# EAGLE board main_board_v1_2 (EAGLE 9.2.2)
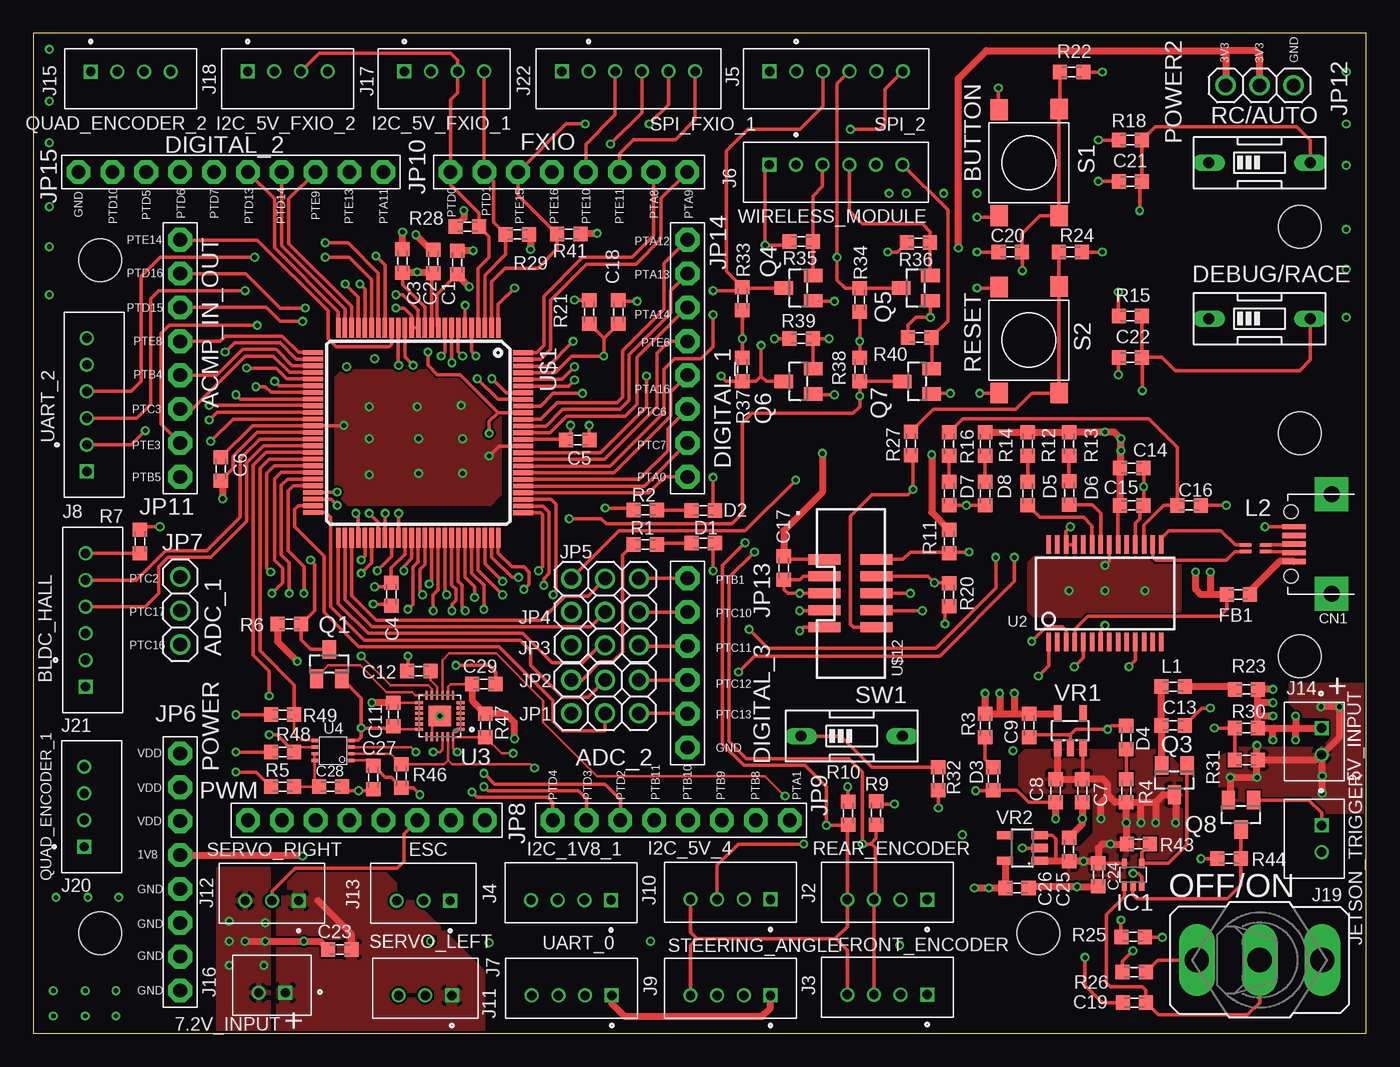
[diagram p9: board, top side]
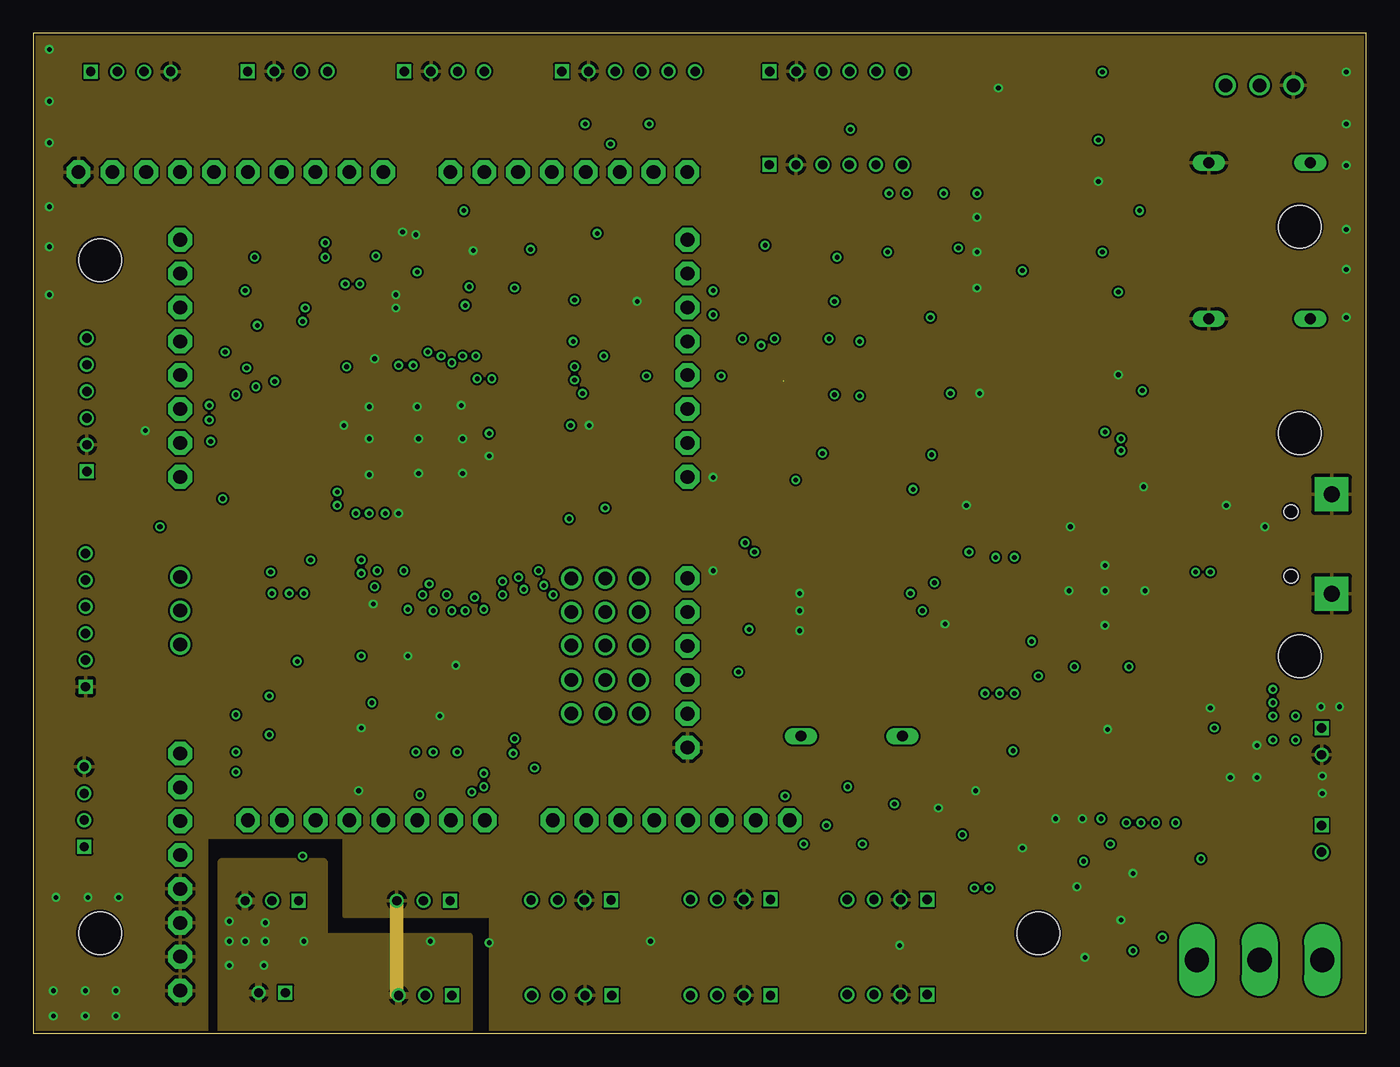
[diagram p10: board, inner layer GND]
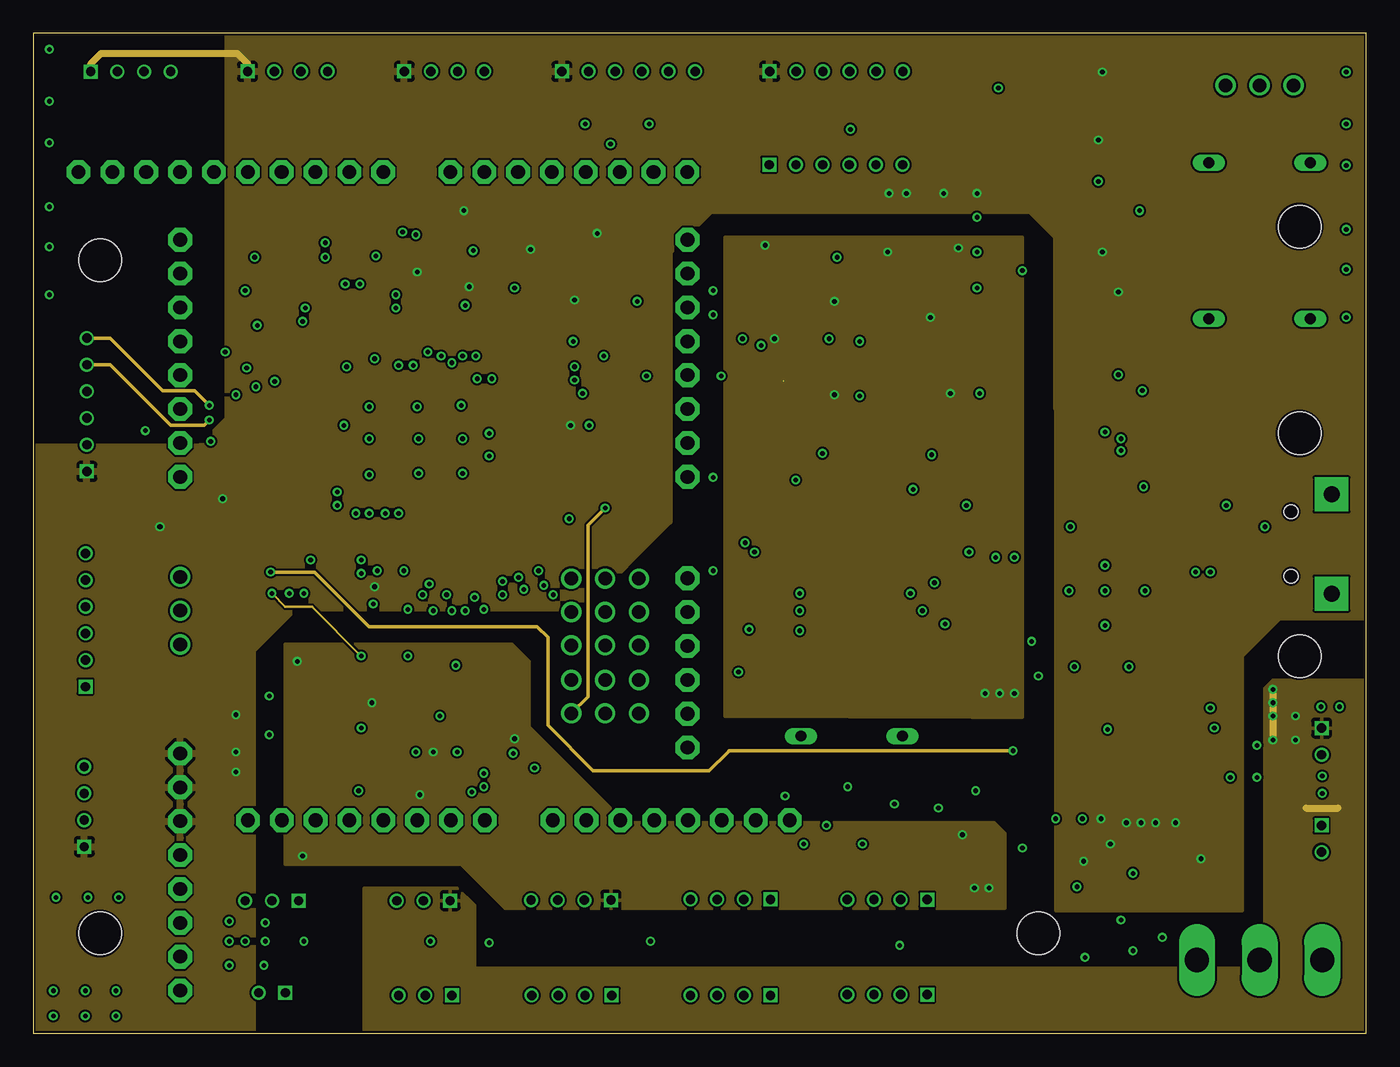
[diagram p11: board, inner layer POWER]
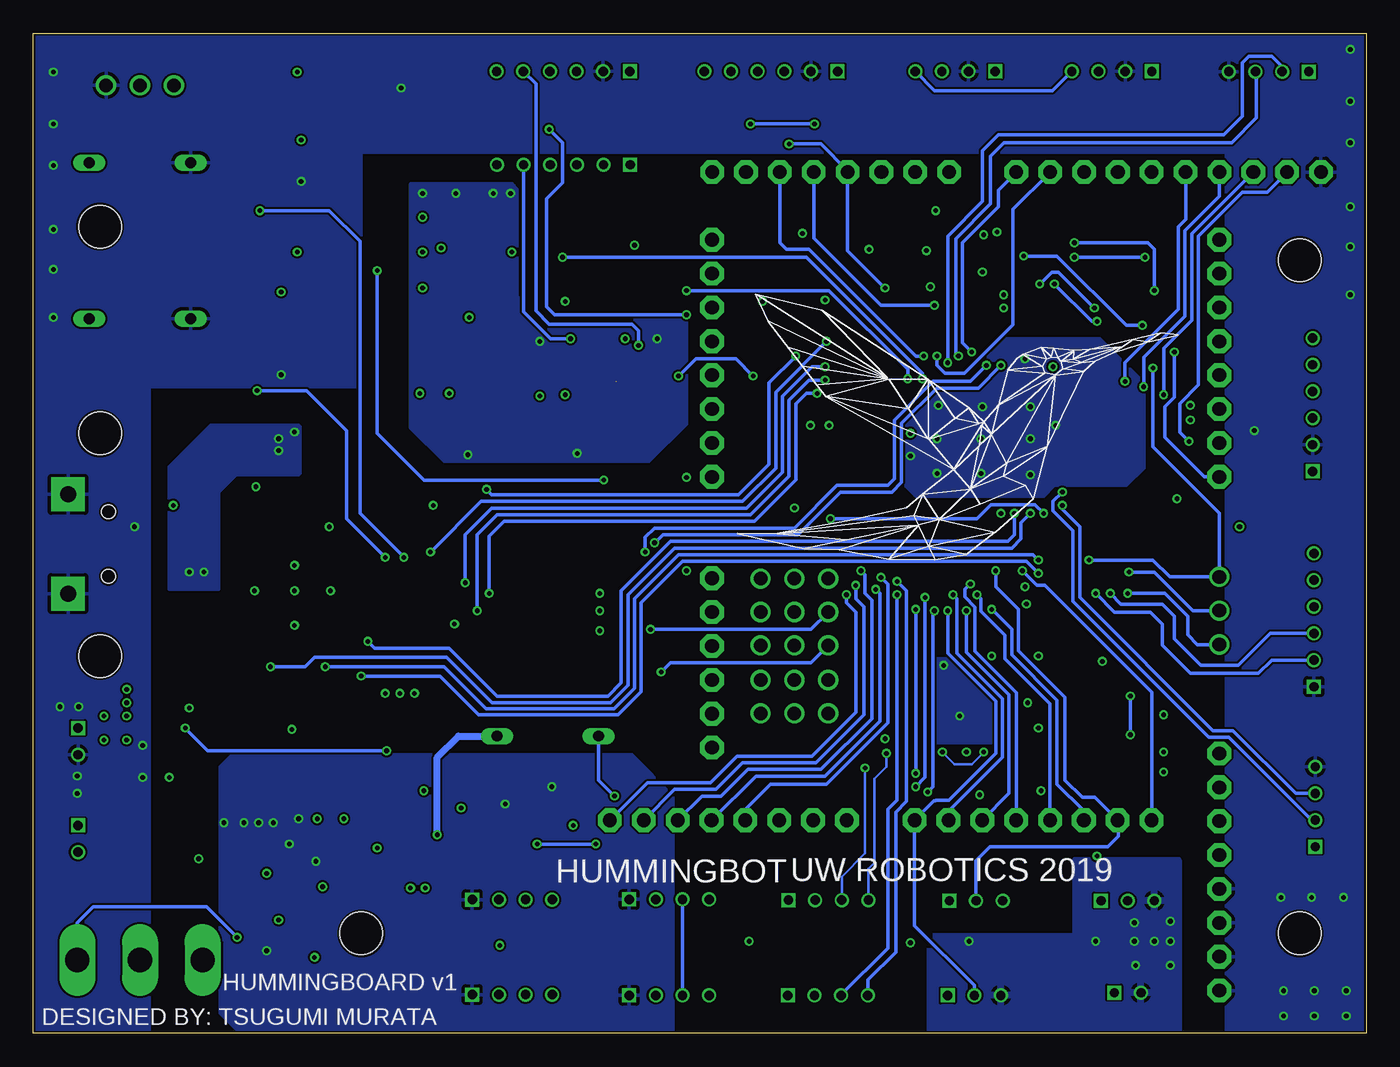
[diagram p12: board, bottom side, seen from below]

Size 100 x 75 mm. Coordinates in mm from the lower left corner, seen from the top.
Outline: 0,0 100,0 100,75 0,75 0,0
Copper layers (1*2*15*16): Top 0.035mm / dielectric 0.11mm / GND 0.035mm / dielectric 1.21mm / POWER 0.035mm / dielectric 0.11mm / Bottom 0.035mm
Design rules "PCBway_4layer_tsugumi *": minimum track width 6mil, minimum drill 12mil, track to track 6mil, track to pad 6mil, pad to pad 6mil, via to via 6mil, smd to smd 6mil, copper to edge 7mil, drill to drill 7mil, minimum pad ring 6mil, minimum via ring 6mil, stop-mask expansion 4mil, vias tented up to drill 25mil, thermal gap 10mil
Holes 3.2 mm at 5,7.5 95,45 95,28.3 75.4,7.5 5,58 95,60.5

## Footprints (pad centres in the part's own frame; a part is rotated, then mirrored left to right if it is on the bottom)
0603SMT = smd 1.05 x 1.08: 1 -0.875,0; 2 0.875,0
MICRO-USB = smd 0.4 x 1.75: 1 -1.3,4.525; 2 -0.65,4.525; 3 0,4.525; 4 0.65,4.525; 5 1.3,4.525 | drill 1.2 pad 2.54 square: GND1 -3.725,1.7; GND2 3.725,1.7 | hole 1.05: -2.425,4.73; 2.425,4.73
EDG-01 = drill 0.813 long: 1 0,-3.81; 2 0,3.81
SC70-5 = smd 0.4 x 0.7: 1 -0.65,-0.85; 2 0,-0.85; 3 0.65,-0.85; 4 0.65,0.85; 5 -0.65,0.85
JST_B4B-PH-K-S(LF)(SN) = drill 0.7 square: 1 3,-0.55 | drill 0.7: 2 1,-0.55; 3 -1,-0.55; 4 -3,-0.55
JST_B6B-PH-K-S(LF)(SN) = drill 0.7 square: 1 5,-0.55 | drill 0.7: 2 3,-0.55; 3 1,-0.55; 4 -1,-0.55; 5 -3,-0.55; 6 -5,-0.55
JST_B3B-PH-K-S(LF)(SN) = drill 0.7 square: 1 2,-0.55 | drill 0.7: 2 0,-0.55; 3 -2,-0.55
JST_B2B-PH-K-S(LF)(SN) = drill 0.7 square: 1 1,-0.55 | drill 0.7: 2 -1,-0.55
1X03 = drill 1.016: 1 -2.54,0; 2 0,0; 3 2.54,0
1X08-BIG = drill 1.016 pad 1.778 octagon: 1 -8.89,0; 2 -6.35,0; 3 -3.81,0; 4 -1.27,0; 5 1.27,0; 6 3.81,0; 7 6.35,0; 8 8.89,0
1X06-BIG = drill 1.016 pad 1.778 octagon: 1 -6.35,0; 2 -3.81,0; 3 -1.27,0; 4 1.27,0; 5 3.81,0; 6 6.35,0
1X10-BIG = drill 1.016 pad 1.778 octagon: 1 -11.43,0; 2 -8.89,0; 3 -6.35,0; 4 -3.81,0; 5 -1.27,0; 6 1.27,0; 7 3.81,0; 8 6.35,0; 9 8.89,0; 10 11.43,0
CHOKE0603 = smd 0.85 x 0.25: 1 -0.75,-0.25; 2 0.75,-0.25; 3 0.75,0.25; 4 -0.75,0.25
SOT23 = smd 1 x 1.4: 1 -0.95,-1.1; 2 0.95,-1.1; 3 0,1.1
TACT_SWITCH_SMT = smd 1.55 x 1.3: 1 -3.975,2.25; 2 3.975,2.25; 3 -3.975,-2.25; 4 4.025,-2.25
M9040P = drill 1.803 long: 1 0,4.699; 2 0,0; 3 0,-4.699
SSOP28DB = smd 0.348 x 1.397: 1 -4.225,-3.656; 2 -3.575,-3.656; 3 -2.925,-3.656; 4 -2.275,-3.656; 5 -1.625,-3.656; 6 -0.975,-3.656; 7 -0.325,-3.656; 8 0.325,-3.656; 9 0.975,-3.656; 10 1.625,-3.656; 11 2.275,-3.656; 12 2.925,-3.656; 13 3.575,-3.656; 14 4.225,-3.656; 15 4.225,3.656; 16 3.575,3.656; 17 2.925,3.656; 18 2.275,3.656; 19 1.625,3.656; 20 0.975,3.656; 21 0.325,3.656; 22 -0.325,3.656; 23 -0.975,3.656; 24 -1.625,3.656; 25 -2.275,3.656; 26 -2.925,3.656; 27 -3.575,3.656; 28 -4.225,3.656
QFN40P300X300X105-25N = smd 0.64 x 0.22: 1 -1.545,1; 2 -1.545,0.6; 3 -1.545,0.2; 4 -1.545,-0.2; 5 -1.545,-0.6; 6 -1.545,-1; 13 1.545,-1; 14 1.545,-0.6; 15 1.545,-0.2; 16 1.545,0.2; 17 1.545,0.6; 18 1.545,1 | smd 0.22 x 0.64: 7 -1,-1.545; 8 -0.6,-1.545; 9 -0.2,-1.545; 10 0.2,-1.545; 11 0.6,-1.545; 12 1,-1.545; 19 1,1.545; 20 0.6,1.545; 21 0.2,1.545; 22 -0.2,1.545; 23 -0.6,1.545; 24 -1,1.545 | smd 1.7 x 1.54: 25 0,0
PSOP-8 = smd 0.25 x 0.5: 1 -0.73,-1.37; 2 -0.23,-1.37; 3 0.27,-1.37; 4 0.77,-1.37; 5 0.77,1.38; 6 0.27,1.38; 7 -0.23,1.38; 8 -0.73,1.38
LQFP100 = smd 1.5 x 0.35: 1 -7.875,6; 2 -7.875,5.5; 3 -7.875,5; 4 -7.875,4.5; 5 -7.875,4; 6 -7.875,3.5; 7 -7.875,3; 8 -7.875,2.5; 9 -7.875,2; 10 -7.875,1.5; 11 -7.875,1; 12 -7.875,0.5; 13 -7.875,0; 14 -7.875,-0.5; 15 -7.875,-1; 16 -7.875,-1.5; 17 -7.875,-2; 18 -7.875,-2.5; 19 -7.875,-3; 20 -7.875,-3.5; 21 -7.875,-4; 22 -7.875,-4.5; 23 -7.875,-5; 24 -7.875,-5.5; 25 -7.875,-6; 51 7.875,-6; 52 7.875,-5.5; 53 7.875,-5; 54 7.875,-4.5; 55 7.875,-4; 56 7.875,-3.5; 57 7.875,-3; 58 7.875,-2.5; 59 7.875,-2; 60 7.875,-1.5; 61 7.875,-1; 62 7.875,-0.5; 63 7.875,0; 64 7.875,0.5; 65 7.875,1; 66 7.875,1.5; 67 7.875,2; 68 7.875,2.5; 69 7.875,3; 70 7.875,3.5; 71 7.875,4; 72 7.875,4.5; 73 7.875,5; 74 7.875,5.5; 75 7.875,6 | smd 0.35 x 1.5: 26 -6.025,-7.875; 27 -5.525,-7.875; 28 -5.025,-7.875; 29 -4.525,-7.875; 30 -4.025,-7.875; 31 -3.525,-7.875; 32 -3.025,-7.875; 33 -2.525,-7.875; 34 -2.025,-7.875; 35 -1.525,-7.875; 36 -1.025,-7.875; 37 -0.525,-7.875; 38 -0.025,-7.875; 39 0.475,-7.875; 40 0.975,-7.875; 41 1.475,-7.875; 42 1.975,-7.875; 43 2.475,-7.875; 44 2.975,-7.875; 45 3.475,-7.875; 46 3.975,-7.875; 47 4.475,-7.875; 48 4.975,-7.875; 49 5.475,-7.875; 50 5.975,-7.875; 76 6,7.875; 77 5.5,7.875; 78 5,7.875; 79 4.5,7.875; 80 4,7.875; 81 3.5,7.875; 82 3,7.875; 83 2.5,7.875; 84 2,7.875; 85 1.5,7.875; 86 1,7.875; 87 0.5,7.875; 88 0,7.875; 89 -0.5,7.875; 90 -1,7.875; 91 -1.5,7.875; 92 -2,7.875; 93 -2.5,7.875; 94 -3,7.875; 95 -3.5,7.875; 96 -4,7.875; 97 -4.5,7.875; 98 -5,7.875; 99 -5.5,7.875; 100 -6,7.875
SWD_1.27MM = smd 0.76 x 2.4: 1 -2.54,-1.94; 2 -2.54,1.94; 3 -1.27,-1.94; 4 -1.27,1.94; 5 0,-1.94; 6 0,1.94; 7 1.27,-1.94; 8 1.27,1.94; 9 2.54,-1.94; 10 2.54,1.94
SOT23-5 = smd 0.55 x 1.2: 1 -0.95,-1.3; 2 0,-1.3; 3 0.95,-1.3; 4 0.95,1.3; 5 -0.95,1.3
TSOT23-5 = smd 0.62 x 1.22: 1 -0.95,-1.3; 2 0,-1.3; 3 0.95,-1.3; 4 0.95,1.3; 5 -0.95,1.3

## Placement (x,y rotation side)
C1  100nF  [0603SMT]  31.8,57.81 90 top
C2  100nF  [0603SMT]  30,57.9 90 top
C3  100nF  [0603SMT]  27.7,57.93 90 top
C4  100nF  [0603SMT]  26.85,32.93 270 top
C5  100nF  [0603SMT]  40.85,44.49 0 top
C6  100nF  [0603SMT]  14.07,42.32 90 top
C7  10uF  [0603SMT]  78.7,18.2 270 top
C8  1uF  [0603SMT]  76.7,18.2 270 top
C9  1uF  [0603SMT]  74.7,23.1 270 top
C11  0.1uF  [0603SMT]  27.01,23.91 90 top
C12  0.1uF  [0603SMT]  28.93,27.17 180 top
C13  100ohm  [0603SMT]  85.5,23.1 0 top
C14  10uF  [0603SMT]  82.4,42.4 0 top
C15  0.1uF  [0603SMT]  82.4,39.6 0 top
C16  0.1uF  [0603SMT]  86.7,39.6 0 top
C17  0.1uF  [0603SMT]  56.3,34.9 270 top
C18  0.1uF  [0603SMT]  43.9,54.1 90 top
C19  0.1uF  [0603SMT]  82.6,2.3 180 top
C20  0.1uF  [0603SMT]  73.3,58.6 180 top
C21  0.1uF  [0603SMT]  82.3,63.9 180 top
C22  0.1uF  [0603SMT]  82.3,50.7 180 top
C23  TBD  [0603SMT]  23,6.3 180 top
C24  0.1u  [0603SMT]  79.9,11.9 90 top
C25  1uF  [0603SMT]  77.7,13.8 90 top
C26  1uF  [0603SMT]  73.8,10.9 0 top
C27  0.1u  [0603SMT]  25.5,19.2 90 top
C28  0.1u  [0603SMT]  22.3,18.5 180 top
C29  0.1uF  [0603SMT]  33.8,26.2 180 top
CN1  MIRCO_B  [MICRO-USB]  99.1,36.7 90 top
D1  LED0603  [0603SMT]  50.26,36.77 0 top
D2  LED0603  [0603SMT]  50.26,39.21 0 top
D3  LED_GREEN  [0603SMT]  72,19.1 270 top
D4  LED_GREEN  [0603SMT]  82,22.2 90 top
D5  TX  [0603SMT]  74.6,40.5 270 top
D6  RX  [0603SMT]  77.72,40.52 270 top
D7  LED0603  [0603SMT]  68.7,40.5 270 top
D8  LED0603  [0603SMT]  71.4,40.5 270 top
DEBUG/RACE  [EDG-01]  92,53.6 270 top
FB1  600ohm@100MHz  [0603SMT]  90.4,32.91 180 top
IC1  OR_SC70-5  [SC70-5]  82.5,11.9 0 top
J2  REAR_ENCODER  [JST_B4B-PH-K-S(LF)(SN)]  64.07,10.58 0 top
J3  FRONT_ENCODER  [JST_B4B-PH-K-S(LF)(SN)]  64.07,3.46 0 top
J4  I2C_1V8_1  [JST_B4B-PH-K-S(LF)(SN)]  40.34,10.54 0 top
J5  SPI_2  [JST_B6B-PH-K-S(LF)(SN)]  60.24,71.6 180 top
J6  WIRELESS_MODULE  [JST_B6B-PH-K-S(LF)(SN)]  60.22,64.6 180 top
J7  UART_0  [JST_B4B-PH-K-S(LF)(SN)]  40.39,3.4 0 top
J8  UART_2  [JST_B6B-PH-K-S(LF)(SN)]  4.57,47.14 270 top
J9  STEERING_ANGLE  [JST_B4B-PH-K-S(LF)(SN)]  52.3,3.4 0 top
J10  I2C_5V_4  [JST_B4B-PH-K-S(LF)(SN)]  52.3,10.6 0 top
J11  SERVO_LEFT  [JST_B3B-PH-K-S(LF)(SN)]  29.4,3.4 0 top
J12  SERVO_RIGHT  [JST_B3B-PH-K-S(LF)(SN)]  17.9,10.5 0 top
J13  ESC  [JST_B3B-PH-K-S(LF)(SN)]  29.27,10.5 0 top
J14  5V_INPUT  [JST_B2B-PH-K-S(LF)(SN)]  96.1,21.9 90 top
J15  QUAD_ENCODER_2  [JST_B4B-PH-K-S(LF)(SN)]  7.31,71.58 180 top
J16  7.2V_INPUT  [JST_B2B-PH-K-S(LF)(SN)]  17.9,3.6 0 top
J17  I2C_5V_FXIO_1  [JST_B4B-PH-K-S(LF)(SN)]  30.83,71.6 180 top
J18  I2C_5V_FXIO_2  [JST_B4B-PH-K-S(LF)(SN)]  19.08,71.6 180 top
J19  JETSON_TRIGGER  [JST_B2B-PH-K-S(LF)(SN)]  96.1,14.6 90 top
J20  QUAD_ENCODER_1  [JST_B4B-PH-K-S(LF)(SN)]  4.37,17 270 top
J21  BLDC_HALL  [JST_B6B-PH-K-S(LF)(SN)]  4.47,31 270 top
J22  SPI_FXIO_1  [JST_B6B-PH-K-S(LF)(SN)]  44.66,71.6 180 top
JP1  [1X03]  42.9,24 180 top
JP2  [1X03]  42.9,26.5 180 top
JP3  [1X03]  42.9,29.1 0 top
JP4  [1X03]  42.9,31.6 0 top
JP5  [1X03]  42.9,34.1 0 top
JP6  POWER  [1X08-BIG]  11.02,12.1 270 top
JP7  ADC_1  [1X03]  11.02,31.7 270 top
JP8  PWM  [1X08-BIG]  24.99,15.98 180 top
JP9  ADC_2  [1X08-BIG]  47.85,15.98 0 top
JP10  FXIO  [1X08-BIG]  40.18,64.6 0 top
JP11  ACMP_IN_OUT  [1X08-BIG]  11.02,50.63 270 top
JP12  POWER2  [1X03]  92,71.1 0 top
JP13  DIGITAL_3  [1X06-BIG]  49.08,27.78 270 top
JP14  DIGITAL_1  [1X08-BIG]  49.08,50.63 90 top
JP15  DIGITAL_2  [1X10-BIG]  14.82,64.6 180 top
L1  4.7u  [0603SMT]  85.5,26 180 top
L2  CHOKE0603  [CHOKE0603]  91.7,36.38 180 top
Q1  BSS138  [SOT23]  22.2,27.7 0 top
Q3  DMP2066LSN  [SOT23]  85.6,19 180 top
Q4  BSS138  [SOT23]  57.4,55.9 90 top
Q5  BSS138  [SOT23]  66.2,55.9 90 top
Q6  BSS138  [SOT23]  57.4,48.9 90 top
Q7  BSS138  [SOT23]  66.3,48.9 90 top
Q8  BSS138  [SOT23]  90.6,16.4 180 top
R1  300  [0603SMT]  45.9,36.67 180 top
R2  300  [0603SMT]  45.9,39.25 180 top
R3  120  [0603SMT]  71.4,23.1 90 top
R4  300  [0603SMT]  82,18.2 270 top
R5  200k  [0603SMT]  18.7,18.5 180 top
R6  10k  [0603SMT]  19.2,30.7 180 top
R7  TBD  [0603SMT]  8,36.9 90 top
R9  10K  [0603SMT]  63.23,16.52 90 top
R10  10K  [0603SMT]  61.13,16.51 90 top
R11  10K  [0603SMT]  68.7,36.9 90 top
R12  300  [0603SMT]  74.6,44.2 90 top
R13  300  [0603SMT]  77.7,44.2 90 top
R14  300  [0603SMT]  71.4,44.2 270 top
R15  100k  [0603SMT]  82.3,53.8 180 top
R16  120  [0603SMT]  68.7,44.2 90 top
R18  100k  [0603SMT]  82.3,67 180 top
R20  10K  [0603SMT]  68.7,32.9 90 top
R21  10K  [0603SMT]  41.7,54.1 90 top
R22  100K  [0603SMT]  77.9,72.1 0 top
R23  0  [0603SMT]  91,25.8 0 top
R24  100K  [0603SMT]  77.8,58.6 0 top
R25  100K  [0603SMT]  82.51,7.24 0 top
R26  100k  [0603SMT]  82.59,4.59 180 top
R27  1K  [0603SMT]  65.84,44.25 270 top
R28  10K  [0603SMT]  32.56,60.5 180 top
R29  10K  [0603SMT]  36.31,59.92 0 top
R30  180K  [0603SMT]  91,22.9 0 top
R31  20K  [0603SMT]  91,20.5 180 top
R32  10k  [0603SMT]  67.9,19.1 90 top
R33  10k  [0603SMT]  53.2,55.1 270 top
R34  10k  [0603SMT]  62,55 270 top
R35  10k  [0603SMT]  57.6,59.4 180 top
R36  10k  [0603SMT]  66.4,59.3 180 top
R37  10k  [0603SMT]  53.2,49.8 90 top
R38  10k  [0603SMT]  62,49.8 90 top
R39  10k  [0603SMT]  57.6,52.1 180 top
R40  10k  [0603SMT]  66.5,52.2 180 top
R41  10k  [0603SMT]  40.17,59.94 0 top
R43  10k  [0603SMT]  82.9,14.2 180 top
R44  10k  [0603SMT]  89.7,13.1 180 top
R46  1k  [0603SMT]  27.6,19.3 270 top
R47  1k  [0603SMT]  33.9,23.1 90 top
R48  1k  [0603SMT]  18.7,21.1 180 top
R49  1k  [0603SMT]  18.7,23.9 180 top
RC/AUTO  [EDG-01]  92,65.3 270 top
S1  BUTTON  [TACT_SWITCH_SMT]  74.7,65.3 90 top
S2  RESET  [TACT_SWITCH_SMT]  74.7,52 90 top
S3  OFF/ON  [M9040P]  92,5.5 270 top
SW1  [EDG-01]  61.4,22.3 270 top
U2  [SSOP28DB]  80.4,33 0 top
U3  ICM-20948  [QFN40P300X300X105-25N]  30.5,23.8 180 top
U4  PCA9306  [PSOP-8]  22.5,21.2 90 top
U$1  MKE14F512LL16  [LQFP100]  28.88,45.05 270 top
U$12  SWD  [SWD_1.27MM]  61.3,33 270 top
U$38  BOARD_INFO  [BOARD_INFO]  78.2,3.2 0 bottom
U$44  TEAM_LOGO  [TEAM_LOGO]  28.3,44.1 0 bottom
VR1  MIC5501  [SOT23-5]  77.8,22.7 0 top
VR2  ADP121-AUJZ18  [TSOT23-5]  74.2,13.9 90 top

## Tracks (layer width: path | path; a pad name or v marks a point on that pad's centre or on a via)
3V3_SPI0_MISO
  Top 0.254: Q5.2 67.28,56.88 R36.1 67.28,60.08 67.3,60.1 66.7,60.7 65.88,60.7 65.7,60.7 62.2,60.7 61.22,61.68 J6.4
3V3_SPI0_MOSI  (via drill 0.35)
  Top 0.254: Q6.2 58.48,49.88 R39.1 v59.7,52.1
  Bottom 0.254: J6.5 63.22,54.12 61.2,52.1 v59.7,52.1
3V3_SPI0_PCS0
  Top 0.254: Q7.2 67.4,52.17 R40.1 68.6,53.42 68.6,61.77 J6.6
3V3_SPI0_SCK
  Top 0.254: Q4.2 58.5,59.38 R35.1 58.48,62.77 59.22,63.52 J6.3
+1.8V  (via drill 0.35)
  Top 0.2: U3.8 31.1,26 31.3,26.2 C29.2 | U3.13 27.02,24.8 C11.2 | U4.1 25.11,20.47 C27.2 | U3.22 30.7,21.3 30.5,21.1 v30,21.1
  Top 0.254: C26.1 72.85,10.97 | v29,17.9 28.48,18.43 R46.2 26.82,19.2 26.38,19.2 C27.2
  Top 0.508: VR2.5 72.92,12.93 C26.1 v70.6,10.9 | C11.2 27,24.8 v25.4,24.8 | R6.2 18.32,29.38 v19.8,27.9 | v36.1,22.1 36.1,23.3 35.42,23.98 R47.2 32.92,24.95 C29.2 | JP6.4 20.13,13.37 v20.2,13.3
  Bottom 0.508: v69.7,14.9 69.7,20.7 68.1,22.3 SW1.2
  other vias: 71.7,10.9
  pour POWER (rank 2): 18.9,29.2 18.9,12.7 32.1,12.7 35.4,9.4 72.9,9.4 72.9,15 72.1,15.8 44.4,15.8 37.2,23 37.2,27.9 35.9,29.2
+3V3  (via drill 0.35)
  Top 0.254: v60.1,47.9 58.55,47.9 Q6.1 | v68.8,48 67.45,48 Q7.1 | v60.1,54.9 58.55,54.9 Q4.1 | v55.6,52.1 R39.2 | Q5.1 v67.3,53.7 66.2,53.7 65.62,53.12 R40.2 | R35.2 56.42,59.1 v54.9,59.1 54.9,64.83 J6.1 | R36.2 64.83,58.6 v64.1,58.6
  Top 0.508: VR1.5 76.83,23.98 C9.1 73.7,23.98 | R3.2 72.5,23.98 v72.5,25.5 | R3.2 73.7,23.98 | v71.4,25.5 R3.2 | v73.6,25.5 73.6,24.07 73.7,23.98 | v69.4,58.9 69.4,71.6 71.5,73.7 89.3,73.7 | JP12.1 89.46,73.54 89.3,73.7 | JP12.2 92,73.4 91.7,73.7 89.3,73.7
  pour POWER (rank 2): 70.4,23.7 74.2,23.7 74.2,59.7 51.9,59.7 51.9,23.8
+3V3_FTDI
  Top 0.254: U2.17 83.33,38.12 84.8,39.6 C16.1 85.83,43.98 83.7,46.1 69.72,46.1 R16.2
+5V  (via drill 0.35)
  Top 0.508: 93.1,22.9 R30.2 91.88,23.7 | 93.1,22.9 94.7,22.9 | 94.7,22.9 J14.1 | 91.88,23.7 91.88,24.8 | 91.88,24.8 R23.2 v93,25.8 | v93,22 93,22.8 93.1,22.9 | v93,23.8 91.97,23.8 91.88,23.7 | v93,24.8 91.88,24.8 | v94.7,23.8 94.7,22.9 | v94.7,22 94.7,22.9
  POWER 0.508: v93,25.8 v93,22 | 95.5,16.9 97.9,16.9
  pour POWER (rank 2): 100,26.5 93,26.5 92.4,25.9 92.4,5.8 91.5,4.9 24.8,4.9 24.8,0 100,0
  pour POWER (rank 2): 24.8,4.9 24.8,10.9 31.8,10.9 33.1,9.6 33.1,4.9
+7.2V
  Top 0.508: C23.1 23.88,7.42 21.35,9.95
  pour Top (rank 2): 18.6,12.8 18.6,0.1 33.5,0.1 33.5,4.5 25.2,12.8
+VDD  (via drill 0.35, 0.38)
  Top 0.254: VR1.3 78.75,19.12 C7.1 | R37.2 v53.2,52.1 R33.2 | v40.6,55 41.67,55 R21.2 | U$1.87 39.91,44.55 C5.1 40.3,44.81 v40.3,45.6 | C2.1 29.99,57.01 29.88,56.91 U$1.11 | C6.1 15,42.38 15,43.3 16.77,45.08 U$1.38 | C3.1 27.7,56.16 29.38,54.48 U$1.12 | U$1.61 27.88,35.94 26.85,34.91 C4.1 26.55,33.5 v25.6,33.5 | U$1.10 30.28,53.02 30.28,55.41 C1.1 | U$12.1 56.53,35.54 C17.1 | R44.2 v87.6,13.1 | v82.5,6.2 81.72,5.42 R26.2 | IC1.5 79.92,12.75 C24.2 | VR2.3 76.45,14.85 76.7,14.6 76.7,12.95 | R15.2 81.4,53.83 v81.4,55.6 | R24.2 v80.2,58.6 | R18.2 v79.9,67 | R22.2 v80.2,72.1 | R48.2 v15.2,21.1 | R5.2 16.73,19.6 v15.2,19.6 | R38.2 v62,51.9 R34.2 | R9.2 63.43,17.2 v64.59,17.2 v64.6,17.2 | R10.2 61.1,17.41 v61.1,18.5 | R49.2 v15.2,23.9 | R7.2 8.22,38 v9.5,38
  Top 0.508: VR1.1 76.85,19.23 C8.1 C7.1 80.22,19.07 80.6,18.7 80.6,17.9 | R4.2 v82,15.8 82.03,15.78 R43.2 v80.8,14.2 80.2,14.2 79.9,13.9 C24.2 79.78,12.9 v78.8,12.9 77.72,12.9 C25.1 77.67,12.95 76.7,12.95 VR2.1 | R4.2 83,17.32 | 83,17.32 84.2,17.32 | v83.1,15.8 83.1,17.23 83,17.32 | 84.2,17.32 v84.2,15.8 | 84.2,17.32 84.78,17.9 Q3.3 85.7,17.8 v85.7,15.8 | 80.6,17.9 81.17,17.32 R4.2 | 80.6,17.9 80.6,17.8 80.1,17.3 v80.1,16.1 | C6.1 14.2,41.31 v14.2,40.1 | v32.3,61.7 32.3,61.12 R28.2 | R29.2 37.3,59.8 v37.3,58.8 | R41.2 41.1,60 v42.3,60 | C3.1 27.75,57.1 v28.8,57.1 29.9,57.1 29.99,57.01 | v67.4,43.4 67.4,39.08 R11.2 | v59.2,43.5 59.2,40.6 56.3,37.7 C17.1 | J7.1 43.39,2.25 44.37,1.27 54.67,1.27 55.3,1.9 J9.1 | v32.7,56 31.8,56.9 C1.1
  POWER 0.508: J15.1 4.31,72.73 5.08,73.5 15.3,73.5 16.08,72.72 J18.1
  other vias: 68.3,63 70.8,63 65.5,63 64.2,63
  pour POWER (rank 2): 76.7,46.8 76.7,9.2 90.7,9.2 90.7,28.3 93.5,31.1 100,31.1 100,46.8
  pour Bottom: 51,53.9 51,45.7 53.8,42.9 69.2,42.9 71.7,45.4 71.7,63.7 64.1,63.7 63.7,63.3 63.7,55.3 62.3,53.9
  pour POWER (rank 2): 0,0 0,43.7 0.3,44 12.5,44 14.6,46.1 14.6,74.9 99.9,74.9 99.9,46.7 76.9,46.7 76.8,46.8 76.8,59.7 74.8,61.7 50.8,61.7 47.7,58.6 47.7,38.4 41.2,31.9 19.6,31.9 16.4,28.7 16.4,0
  pour Bottom: 52,13.1 52,0 84.5,0 86,1.5 86,20 85.1,20.9 55.1,20.9 52,17.8 52,13.2
  pour Top: 76.3,21.2 74.4,21.2 74.1,20.9 74,20.8 74,18.9 74,18.6 74.5,18.1 77.3,18.1 79.3,18.1 79.4,18 79.6,17.8 79.6,15 78.5,13.9 78.3,13.9 77.5,13.1 77.5,12.4 77.5,11.8 77.7,11.6 84.1,11.6 86.1,13.6 86.1,19.9 84.8,21.2
+VUSB  (via drill 0.35)
  Top 0.254: U2.20 81.38,39.45 C15.1 | U2.4 78.12,30.32 79.1,31.3 89,31.3 89.53,31.82 FB1.2
  Top 0.508: C15.1 C14.1 81.6,42.48 v81.6,43.7 v81.6,44.6 | v81.6,44.6 81.1,45.1 v80.4,45.1 77.72,45.1 R13.2 R12.2 R14.1 | v81.6,44.6 81.62,44.58 | FB1.2 88.3,32.91 | 88.3,32.91 87.59,32.91 87.2,33.3 v87.2,34.6 | v88.3,34.6 88.3,32.91
  pour Bottom: 86.1,33.3 89.8,33.3 89.8,42.5 86.9,45.4 86.7,45.6 80.1,45.6 80,45.5 80,42 80.1,41.9 82.9,41.9 84.8,41.9 86,40.7 86.1,40.6
ACMP0_IN3
  Top 0.254: U$1.26 19.91,51.08 18.68,52.3 14.4,52.3 14,51.9 JP11.4
ACMP1_OUT  (via drill 0.35)
  Top 0.254: U$1.27 19.73,50.58 18.5,51.8 15.1,51.8 v14.4,51.1
  Bottom 0.254: JP11.8 12.14,41.74 15.1,44.7 15.1,47 14.4,47.7 v14.4,51.1
ACMP2_IN0  (via drill 0.35)
  Top 0.254: U$1.21 24.88,55.82 v24.5,56.2 | v20.4,54.4 18.5,54.4 15.92,56.98 JP11.2
  Bottom 0.254: v20.4,54.4 23.1,57.1 23.6,57.1 v24.5,56.2
ACMP2_IN1  (via drill 0.35)
  Top 0.254: v23.4,56.2 24.38,55.22 U$1.22 | JP11.3 17.46,54.44 18.5,53.4 v20.2,53.4
  Bottom 0.254: v23.4,56.2 20.6,53.4 v20.2,53.4
ACMP2_IN3_/_FTM0_FLT1
  Top 0.254: U$1.17 26.88,51.68 26.7,51.5 22.7,51.5 22.1,52.1 22.1,54.2 16.8,59.5 11.04,59.5 JP11.1
ADC0_SE1_/_ACMP0_IN1_/_FTM1_CH1  (via drill 0.35)
  Top 0.254: U$1.78 38.85,40.05 39.2,39.7 39.2,33.1 v39,32.9
  Bottom 0.254: JP9.8 53.92,18.8 49.2,18.8 47.2,20.8 41.6,20.8 38.3,24.1 38.3,31.6 39,32.3 v39,32.9
ADC0_SE5_/_PTB1
  Top 0.254: U$1.53 23.88,32.82 25.7,31 38.1,31 39.9,32.8 41.6,32.8 JP5.2
ADC0_SE10_/_ACMP0_IN5  (via drill 0.35)
  Top 0.254: v16,49.9 18.2,49.9 19,49.1 20.98,49.1 U$1.30 | v20.8,35.5 21.1,35.2 21.1,31.7 20.1,30.7 R6.1 20.07,29.52 20.8,28.8 Q1.3
  Bottom 0.254: v20.8,35.5 16,35.5 14.74,34.24 JP7.1 11.02,39.02 16,44 v16,49.9
ADC0_SE11_/_ACMP0_IN4
  Top 0.254: JP11.6 11.92,46.82 15.9,50.8 18,50.8 19.23,49.58 U$1.29
ADC0_SE14_/_PTC16  (via drill 0.35)
  Top 0.2: U3.11 29.9,25.8 29.6,26.1 26.8,26.1 v24.6,28.3
  Top 0.254: U$1.44 18.57,42.08 18.1,41.6 18.1,35.5 18.7,34.9 18.7,33.8 v17.9,33
  POWER 0.2: v24.6,28.3 20.9,32 18.9,32 v17.9,33
  Bottom 0.254: JP7.3 12.66,29.16 13.4,29.9 13.4,31.3 15.1,33 v17.9,33
ADC0_SE15_/_PTC17  (via drill 0.35)
  Top 0.254: R31.2 R30.1 v88.6,22.9 | U$1.43 18.07,42.58 17.5,42 17.5,34.9 v17.8,34.6
  POWER 0.254: v17.8,34.6 21.1,34.6 25.2,30.5 37.8,30.5 38.6,29.7 38.6,23.1 42,19.7 50.7,19.7 52.1,21.1 52.2,21.2 v73.5,21.2
  Bottom 0.254: JP7.2 13,31.7 15.9,34.6 v17.8,34.6 | v88.6,22.9 86.9,21.2 v73.5,21.2
ADC1_SE2_/_FTM3_CH4  (via drill 0.35)
  Top 0.254: JP9.3 44.04,17.44 44.1,17.5 42.9,18.7 34.6,18.7 v33.8,19.5 | U$1.71 32.88,34.52 33.8,33.6 v33.8,31.8
  Bottom 0.254: v33.8,31.8 v33.8,19.5
ADC1_SE3_/_FTM3_CH5_/_NMI_B  (via drill 0.35)
  Top 0.254: v33.8,18.5 34.1,18.2 40.9,18.2 41.5,17.6 JP9.2 | U$1.70 32.38,34.22 33.1,33.5 v33.1,32.7
  Bottom 0.254: v33.1,32.7 33.1,19.2 v33.8,18.5
ADC1_SE6_/_ACMP1_IN6_/_FTM0_FLT3  (via drill 0.35)
  Top 0.254: v32.4,31.7 32.18,31.92 32.18,33.62 31.88,33.92 U$1.69 | v32.9,18.1 33.3,17.7 38.6,17.7 39,17.3 38.96,17.26 JP9.1
  Bottom 0.254: v32.4,31.7 32.5,31.6 32.5,18.5 v32.9,18.1
ADC2_SE8_/_FTM3_CH3  (via drill 0.35)
  Top 0.254: v36.4,34.2 35.9,34.2 34.38,35.72 U$1.74
  Bottom 0.254: JP9.4 46.58,16.82 44.7,18.7 40.5,18.7 35.9,23.3 35.9,33.7 v36.4,34.2
ADC2_SE9_/_FTM3_CH2  (via drill 0.35)
  Top 0.254: U$1.75 34.88,36.02 35.9,35 36.8,35 37.2,34.6 37.2,33.7 v36.8,33.3
  Bottom 0.254: v36.8,33.3 36.5,33 36.5,23.4 40.6,19.3 45.8,19.3 JP9.5
ADC2_SE10_/_FTM3_CH1  (via drill 0.35)
  Top 0.254: U$1.76 38.05,39.05 38.2,38.9 38.2,35 v37.9,34.7
  Bottom 0.254: JP9.6 49.84,17.8 48.4,17.8 46.4,19.8 40.9,19.8 37.1,23.6 37.1,32.5 37.6,33 37.6,34.4 v37.9,34.7
ADC2_SE11_/_FTM3_CH0  (via drill 0.35)
  Top 0.254: U$1.77 38.25,39.55 38.7,39.1 38.7,34.5 38.3,34.1 v38.3,33.6
  Bottom 0.254: JP9.7 51.88,18.3 48.8,18.3 46.8,20.3 41.3,20.3 37.7,23.9 37.7,32 38.3,32.6 v38.3,33.6
CLK_OUT_/_FTM2_CH5
  Top 0.254: JP15.4 18.63,59.07 23.38,54.32 U$1.24
D+
  Top 0.254: L2.1 94.5,36.63 CN1.3
D-
  Top 0.254: L2.4 94.5,36.13 CN1.2
DAC0_OUT
  Top 0.254: U$1.23 23.88,54.52 19.17,59.23 19.17,62.6 JP15.3
DIGITAL_FIVE
  Top 0.254: JP1.1 49.05,24 JP13.5
DIGITAL_FOUR
  Top 0.254: JP2.1 JP13.4
DIGITAL_ONE
  Top 0.254: JP13.1 45.47,34.13 JP5.3
DIGITAL_THREE
  Top 0.254: JP3.3 45.49,29.05 JP13.3
DIGITAL_TWO
  Top 0.254: JP4.3 JP13.2
FTM0_CH0_/_ADC1_SE7  (via drill 0.35)
  Top 0.254: U$1.68 31.38,33.62 31.7,33.3 31.7,32.5 31.4,32.2 v31.4,31.7
  Bottom 0.254: v31.4,31.7 31.4,28.5 27.8,24.9 27.8,21 31.3,17.5 32.27,17.5 32.33,17.44 32.42,17.44 JP8.1 33.88,8.08 29.4,3.6 J11.2
FTM0_CH1_/_ADC1_SE8  (via drill 0.35)
  Top 0.254: U$1.67 30.88,33.02 v31,32.9
  Bottom 0.254: JP8.2 31.34,16.66 27.3,20.7 27.3,25.1 30.7,28.5 30.7,32.6 v31,32.9
FTM0_CH2_/_ADC1_SE9  (via drill 0.35)
  Top 0.254: J12.2 17.9,10.65 19.65,12.4 27.3,12.4 27.8,12.9 27.8,14.98 JP8.3 | v30,31.7 30,32.9 30.38,33.28 U$1.66
  Bottom 0.254: v30,31.7 30,28.6 26.8,25.4 26.8,18 28.8,16 JP8.3
FTM0_CH3_/_ADC1_SE14  (via drill 0.35)
  Top 0.254: U$1.65 29.88,33.88 v29.7,33.7
  Bottom 0.254: v29.7,33.7 30.1,33.3 30.1,32.73 29.34,31.97 29.34,28.64 26.26,25.56 JP8.4
FTM0_CH4_/_ADC1_SE15  (via drill 0.35)
  Top 0.254: U$1.64 29.38,35.18 29,34.8 29,33.1 v29.2,32.9
  Bottom 0.254: v29.2,32.9 28.9,32.6 28.9,31.67 27.1,29.87 27.1,28.1 23.72,24.72 JP8.5
FTM0_CH5_/_ADC2_SE3  (via drill 0.35)
  Top 0.254: v28.1,31.8 28.5,32.2 28.5,35 28.88,35.38 U$1.63
  Bottom 0.254: v28.1,31.8 26.6,30.3 26.6,28.4 23.2,25 23.2,18.7 21.18,16.68 JP8.6
FTM0_CH6  (via drill 0.35)
  Top 0.254: U$1.62 28.38,35.62 27.8,35.04 v27.8,34.7
  Bottom 0.254: v27.8,34.7 27.8,33.5 26.1,31.8 26.1,28.7 22.6,25.2 22.6,19 21.3,17.7 20.36,17.7 JP8.7 18.6,15.94 18.6,14.8 19.4,14 28.22,14 29.27,12.95 J13.2
FTM0_CH7_/_ADC2_SE2  (via drill 0.35)
  Top 0.254: U$1.59 26.88,35.78 v25.8,34.7
  Bottom 0.254: JP8.8 16.1,25.6 24.1,33.6 24.7,33.6 v25.8,34.7
FTM0_FLT0&2_/_TRGMUX_IN6_/_ACMP2_OUT  (via drill 0.35)
  Top 0.254: JP11.7 9.6,45.7 9.6,52.5 10.2,53.1 v16.8,53.1 | v25.7,58.3 26.38,57.62 U$1.18
  Bottom 0.254: v16.8,53.1 18,53.1 23.2,58.3 v25.7,58.3
FTM1_CH2_/_ADC0_SE12  (via drill 0.35)
  Top 0.254: U$1.46 19.48,41.08 19.11,40.71 19.11,36.19 20.3,35 v20.3,33
  Bottom 0.254: v20.3,33 18.9,31.6 16.2,31.6 15.3,30.7 15.3,29.1 13.2,27 8.1,27 7.1,28 J21.2
FTM1_CH3_/_ADC0_SE13  (via drill 0.35)
  Top 0.254: U$1.45 19.07,41.58 18.6,41.1 18.6,35.9 19.2,35.3 v19.2,33
  Bottom 0.254: v19.2,33 18.4,32.2 15.3,32.2 14.4,31.3 14.4,29.6 12.4,27.6 9.6,27.6 7.2,30 J21.3
FTM1_CH6_/_ADC0_SE8
  Top 0.254: U$1.40 17.27,44.08 16,42.8 16,38.4 13.3,35.7 10.1,35.7 9.4,35 9.4,33 8.4,32 J21.4
FTM1_CH7_/_ADC0_SE9
  Top 0.254: J21.5 7.72,34 9.93,36.21 13.01,36.21 15.5,38.7 15.5,43.1 16.98,44.58 U$1.39
FTM1_QD_PHA_/_ADC0_SE7  (via drill 0.35)
  Top 0.254: U$1.47 22.77,40.58 v22.8,40.6
  Bottom 0.254: J20.2 4.1,16 10.3,22.2 11.8,22.2 22,32.4 22,37.7 23.5,39.2 23.5,39.9 v22.8,40.6
FTM1_QD_PHB_/_ADC0_SE6  (via drill 0.35)
  Top 0.254: U$1.48 22.32,40.08 v22.8,39.6
  Bottom 0.254: v22.8,39.6 22.8,39.3 21.5,38 21.5,32.7 11.5,22.7 10,22.7 5.3,18 J20.3
FTM2_CH4_/_FXIO_D4_/_TRGMUX_OUT4  (via drill 0.35)
  Top 0.254: JP10.5 41.45,66.68 43.66,68.89 J22.3 | U$1.6 32.4,52.95 v32.4,54.6
  Bottom 0.254: JP10.5 41.45,59.65 36.4,54.6 v32.4,54.6
FTM2_CH6_/_FXIO_D2_/_TRGMUX_OUT6  (via drill 0.35)
  Top 0.254: U$1.2 34.38,56.38 35.4,57.4 37.85,57.4 39.3,58.84 R41.1 36.37,62.87 JP10.3 39.97,68.2 v41.4,68.2 | J22.5 47.66,69.66 v46.2,68.2
  Bottom 0.254: v41.4,68.2 v46.2,68.2
FTM2_CH7_/_FXIO_D3_/_TRGMUX_OUT7  (via drill 0.35)
  Top 0.254: U$1.1 34.88,54.68 v36.1,55.9 | J22.4 45.66,69.06 v43.3,66.7
  Bottom 0.254: v43.3,66.7 40.9,66.7 38.91,64.71 JP10.4 38.91,58.71 v36.1,55.9
FTM2_QD_PHA_/_TCLK2  (via drill 0.35)
  Top 0.254: v31.4,50.3 31.38,50.32 U$1.8
  Bottom 0.254: J15.2 6.31,72.51 7.1,73.3 8.8,73.3 9.3,72.8 9.3,68.8 10.7,67.4 27.6,67.4 28.8,66.2 28.8,62.4 31.4,59.8 v31.4,50.3
FTM2_QD_PHB_/_BUSOUT  (via drill 0.35)
  Top 0.254: U$1.9 30.88,51.08 v30.6,50.8
  Bottom 0.254: v30.6,50.8 30.8,51 30.8,59.6 28.2,62.2 28.2,65.8 27.2,66.8 10.1,66.8 8.25,68.65 8.25,72.07 J15.3
FXIO_D0_/_ADC2_SE0
  Top 0.254: J18.3 21.43,73.5 31.3,73.5 31.83,72.97 J17.3 31.83,70.55 31.29,70.01 JP10.1 31.29,63.65 33.44,61.5 R28.1 34.2,59.73 34.2,58.2 33.38,57.38 U$1.4
FXIO_D1_/_ADC2_SE1
  Top 0.254: U$1.3 33.88,56.87 35.44,58.42 R29.1 34.53,60.83 34.53,63.9 JP10.2 J17.4
  Bottom 0.254: J18.4 23.53,70.7 32.38,70.7 J17.4
FXIO_D6_/_PTA8
  Top 0.254: JP10.7 46.53,59.83 44.9,58.2 41.2,58.2 38.3,55.3 38.3,51.6 37.75,51.05 U$1.100
FXIO_D7_/_PTA9
  Top 0.254: U$1.99 38.05,50.55 38.8,51.3 38.8,55 41.5,57.7 45.2,57.7 47.1,59.6 47.1,62.63 JP10.8
GND  (via drill 0.35)
  Top 0.2: 29.9,23.2 U3.20 | 25.38,18.2 C27.1 | 23.34,18.34 C28.1 | U3.18 27.1,22.8 26.94,22.96
  Top 0.254: U2.25 U2.26 77.47,37.67 v77.8,38 | D8.2 71.38,39.6 v70,39.6 68.72,39.6 D7.2 | v71,48 72.42,48 S2.1 | v70.8,55.9 72.38,55.9 S2.2 | v70.8,58.6 C20.2 | v70.8,61.2 72.33,61.2 S1.1 | v79.9,63.9 C21.2 | v72.4,70.9 72.4,69.33 S1.2 | v81.4,49.4 81.4,50.67 C22.2 | C6.2 16.45,45.58 U$1.37 23.27,45.58 v23.3,45.6 | J8.2 7.34,44.14 v8.4,45.2 | v27.4,39 27.4,37.2 U$1.60 | v25.5,32.2 26.85,32.2 C4.2 | U$1.86 34.95,44.05 v34.2,43.3 | C5.2 41.7,44.52 v41.7,45.6 | v27.2,55.4 27.7,55.4 28.88,54.22 U$1.13 U$1.14 28.38,53.82 27.8,54.4 v27.2,54.4 | C18.2 43.98,54.9 v45.3,54.9 | D4.2 80.88,23.07 v80.6,22.8 78.2,22.8 77.8,22.4 | 77.8,22.4 VR1.2 | C8.2 74.7,17.32 73.8,18.23 D3.2 71.97,18.2 v70.7,18.2 | v82.5,12 82.9,12 83.15,11.75 IC1.3 | U$12.3 57.77,34.27 57.52,34.02 C17.2 56.33,34 56.33,33.27 56.6,33 v57.5,33 U$12.5 | U$12.7 59.33,31.7 v57.5,31.7 | U$12.9 57.76,30.46 v57.5,30.2 | v81.6,8.5 81.6,7.21 | VR2.2 v74.2,13.9 | C14.2 83.3,42.38 v83.3,41 83.3,39.62 C15.2 83,39.33 83,38.6 82.67,38.27 U2.18 | CN1.5 v92.4,38 | 23.34,18.34 23.48,18.2 v24.4,18.2 25.38,18.2 | C11.1 26.94,22.96 26.88,22.9 v24.6,22.9 | v24.6,22.9 24.6,22.2 24.37,21.97 U4.4 | U2.7 80.08,30.27 v80.4,30.6 | v89.5,39.6 C16.2 | Q1.2 24.6,25.15 v24.6,22.9 | v78.9,5.7 78.9,3.6 80.2,2.3 C19.2 | v31.7,27.6 34.2,27.6 34.67,27.12 C29.1 | v28.1,28.3 28.1,27.21 C12.2 | R32.1 v67.9,16.9 | C13.2 87.67,24.4 v88.3,24.4 | D1.2 51,36.63 v51,34.7 | v51,41.7 51,39.34 D2.2 | R20.1 68.4,31.73 v68.4,30.7 | U2.21 80.72,35.42 v80.4,35.1 | C9.2 74.88,22.4 77.8,22.4 | U3.25 29.9,23.2
  Top 0.508: v76.7,16.1 C8.2 | C7.2 v78.7,16.1 78.7,15.68 C25.2 | 81.6,7.21 R25.1 | J14.2 96.25,20.5 R31.1 | v15.9,6.9 v20.3,6.9 21.52,6.9 C23.2 | Q8.2 89.8,17.65 v89.8,19.2 v91.8,19.2 91.8,20.43 R31.1 | C26.2 74.78,11 v78.3,11 79.88,11 C24.1 | v33,58.7 31.82,58.7 C1.2 | C3.2 v27.7,60.1 | v28.7,59.9 28.69,59.89 29.8,58.77 C2.2 | R31.1 91.8,20.57 v91.8,21.6 | J14.2 98,22.25 v98,24.5 v96.6,24.5 | v96.7,18 v96.7,19.3 96.7,20.85 J14.2
  GND 1.016: J13.3 27.27,2.98 J11.3
  other vias: 29.8,6.9 34.2,6.8 46.3,6.9 65,6.6 25.6,50.6 30.5,23.8 28.9,44.6 32.2,44.6 28.8,47 32.1,47.1 25.2,47 25.2,41.9 28.9,42 32.2,42 25.2,44.6 80.4,33.2 77.7,33.2 83.4,33.2 14.7,6.9 17.4,8.3 17.4,6.9 17.3,5.1 14.7,8.4 14.7,5.1 1.2,73.8 1.2,69.9 1.5,1.3 3.9,1.3 6.2,1.3 1.5,3.2 3.9,3.2 6.2,3.2 1.7,10.2 4.1,10.2 6.4,10.2 1.2,66.8 1.2,62 1.2,59 1.2,55.4 98.5,72.1 98.5,68.2 98.5,65.1 98.5,60.3 98.5,57.3 98.5,53.7
  pour GND: 0,75 0,0 13,0 13,14.7 23.3,14.7 23.3,8.8 34.3,8.8 34.3,0 100,0 100,75
  pour GND: 14.1,0.1 14.1,12.9 21.8,12.9 21.8,7.3 32.7,7.3 32.7,0.1
  pour Top: 22.7,48.8 22.7,40.6 23.6,39.7 31,39.7 34.3,39.7 34.8,40.2 35,40.4 35,44.4 35,49.2 34.5,49.7 23.2,49.7 22.8,49.3 22.7,49.2 22.7,48.9
  pour Bottom: 31.2,28.1 28.2,25.1 27.9,24.8 27.9,21.8 31.6,21.8 32.4,21.8 32.4,28.1
  pour Bottom: 16.7,48.8 16.7,42.4 18,41.1 23.4,41.1 24.2,40.3 33.8,40.3 34.8,41.3 34.8,45.8 28.5,52.1 20,52.1
  pour Top: 75.2,35.7 85.6,35.7 85.7,35.6 86,35.3 86,32.6 86,31.7 85.6,31.3 78.8,31.3 75.7,31.3 75.1,31.3 74.7,31.7 74.7,34.8 74.7,35.3 75.1,35.7
  pour Top: 89,19.6 89,18.2 89.7,17.5 94.1,17.5 95.7,17.5 96.6,16.6 99.6,16.6 100,16.6 100,26.2 94.3,26.2 94.3,24.8 95.3,23.8 97,23.8 97.4,23.4 97.4,22.1 96.7,21.4 92,21.4 89.8,21.4 89.2,20.8 89,20.6 89,19.7
  pour Top: 13.9,12.3 13.9,0 17.4,0 17.6,0 17.6,12.2 17.6,12.3
  pour Bottom: 14.1,13 14.1,0.1 32.7,0.1 32.7,0.7 32.7,7.3 21.8,7.3 21.8,13
  pour Bottom: 0,75 99.9,75 99.9,0 91.3,0 91.3,46.6 91.3,48.5 75.4,48.5 75.4,66.1 65.4,66.1 60.6,66.1 15.2,66.1 10.6,66.1 10.5,66 10.5,0.7 10.5,0 0.1,0 0,0.1
I2C0_SCL  (via drill 0.35)
  Top 0.254: J3.3 J2.3 63.17,10.13 63.17,13.93 62.9,14.2 62.8,14.2 | v54.1,36.1 52.2,34.2 52.2,21.9 53.5,20.6 61.2,20.6 62.2,19.6 v62.2,14.2 62.8,14.2 | U$1.15 27.88,50.72 v28.5,50.1 | J10.3 51.3,12.6 52.9,14.2 v57.8,14.2 | 62.8,14.2 63.23,14.63 R9.1
  Bottom 0.254: v54.1,36.1 54.1,37.2 53.4,37.9 42.9,37.9 39.69,41.11 35.89,41.11 35.4,41.6 35.4,46 32.5,48.9 29.7,48.9 v28.5,50.1 | J10.3 J9.3 | v57.8,14.2 v62.2,14.2
I2C0_SDA  (via drill 0.35)
  Top 0.254: 61.07,15.57 R10.1 | J10.4 49.3,7.6 49.8,7.1 | 49.8,7.1 60.17,7.1 60.19,7.12 | 60.19,7.12 61.07,8 J2.4 61.07,15.57 | J9.4 49.3,6.6 49.8,7.1 | J3.4 61.07,6.23 60.19,7.12 | 61.07,15.57 61.05,15.6 v59.5,15.6 59.5,18.5 57.9,20.1 53.3,20.1 51.7,21.7 51.7,35.1 v53.4,36.8 | U$1.16 27.38,50.12 v27.4,50.1
  Bottom 0.254: v53.4,36.8 53.38,36.8 52.77,37.41 42.62,37.41 39.43,40.6 35.6,40.6 34.86,41.34 34.86,45.74 32.2,48.4 29.1,48.4 v27.4,50.1
I2C1_1.8_SCL  (via drill 0.35)
  Top 0.2: v37.6,19.9 37.3,20.2 31.4,20.2 31.1,20.5 | U4.2 26.8,20.97 R46.1 27.62,20.2 30.8,20.2 31.1,20.5 | U3.23 31.1,20.5
  Bottom 0.2: v37.6,19.9 37.6,13.5 39.34,11.76 J4.3
I2C1_1.8_SDA  (via drill 0.35)
  Top 0.2: v36,21 35.12,21 R47.1 31.53,22.23 U3.24 31.5,21.4 v31.8,21.1 | U4.3 28.33,21.47 v28.7,21.1
  Bottom 0.2: J4.4 37.34,12.36 36.9,12.8 36.9,19.1 36,20 v36,21 | v28.7,21.1 29.6,20.2 30.9,20.2 v31.8,21.1
I2C1__SCL  (via drill 0.35)
  Top 0.2: U4.6 19.95,21.47 R48.1
  Top 0.254: U$1.41 17.48,43.58 16.5,42.6 16.5,28.37 17.7,27.17 v17.7,25.3 | R48.1 18.27,22.4 v17.7,22.4
  Bottom 0.254: v17.7,25.3 v17.7,22.4
I2C1_SDA
  Top 0.2: R49.1 19.57,22.52 20.13,21.97 U4.5
  Top 0.254: U$1.42 17.68,43.08 17,42.4 17,28.7 19.57,26.12 R49.1
JTAG_TCLK/SWD_CLK  (via drill 0.35)
  Top 0.254: v40.6,50 39.65,49.05 U$1.96 | R20.2 68.72,33.8 v67.6,33.8 67.13,34.27 66.83,34.27 66.6,34.27 U$12.4
  Bottom 0.254: v40.6,50 41.6,50 43.8,47.8 43.8,42.1 46.51,39.39 65.61,39.39 67.6,37.4 v67.6,33.8
JTAG_TDI  (via drill 0.35)
  Top 0.254: U$1.95 40.15,48.55 v40.6,49 | U$12.8 63.27,31.7 v66.7,31.7
  Bottom 0.254: v40.6,49 41.8,49 43.3,47.5 43.3,41.8 46.2,38.9 65.2,38.9 66.7,37.4 v66.7,31.7
JTAG_TDO/SWO  (via drill 0.35)
  Top 0.254: U$1.92 38.05,47.05 39,48 v41.2,48 | U$12.6 v65.8,33
  Bottom 0.254: v41.2,48 42,48 42.79,47.21 42.79,41.51 45.9,38.4 64.7,38.4 65.8,37.3 v65.8,33
JTAG_TMS/SWD_DIO  (via drill 0.35)
  Top 0.254: v40.5,51.9 38.65,50.05 U$1.98 | v70.2,36.1 68.78,36.1 R11.1 68.58,36.15 68.53,36.1 65.8,36.1 65.24,35.54 U$12.2
  Bottom 0.254: v40.5,51.9 44.3,48.1 44.3,42.4 46.8,39.9 66.4,39.9 v70.2,36.1
JTAG_TRST_B  (via drill 0.35)
  Top 0.254: U$1.97 39.12,49.55 40.38,50.8 v42.8,50.8 42.8,52.12 | R27.2 66,43.22 v66,40.8 65.6,40.4 62.9,40.4 61.3,38.8 61.3,30.7 61.54,30.46 U$12.10 | 42.8,52.12 R21.1 | 42.8,52.12 C18.1
  Bottom 0.254: v42.8,50.8 44.8,48.8 44.8,42.7 47.09,40.41 65.61,40.41 v66,40.8
N$1
  Top 0.254: R16.1 D7.1
N$2
  Top 0.254: D8.1 R14.2
N$3
  Top 0.254: D1.1 46.88,36.77 R1.1
N$4
  Top 0.254: J21.6 7.97,36 R7.1
N$5
  Top 0.254: R2.1 49.34,39.25 D2.1
N$6  (via drill 0.35)
  Top 0.254: R2.2 44.88,39.4 v42.9,39.4
  POWER 0.254: v42.9,39.4 41.6,38.1 41.6,25.24 JP1.3
N$7
  Top 0.254: R1.2 44.2,35.84 44.2,28.6 43.46,27.86 42.53,27.86 41.17,26.49 JP2.3
N$8
  Top 0.254: R3.1 71.4,20.57 D3.1
N$9
  Top 0.254: D4.1 R4.1
N$10
  Top 0.2: U3.10 30.3,26 29.8,26.5 C12.1
N$11
  Top 0.508: R23.1 89.92,26 L1.1
N$12
  Top 0.254: L2.2 90.17,36.63 89.1,37.7 85.2,37.7 84.62,37.12 U2.15
N$13
  Top 0.254: L2.3 90.13,36.13 89.5,35.5 84.2,35.5 83.97,35.73 U2.16
N$14
  Top 0.254: U2.23 79.42,38.08 78.8,38.7 75.53,38.7 D5.2
N$15
  Top 0.254: R12.1 D5.1
N$16
  Top 0.2: R5.1 C28.2 21.12,18.8 U4.8 U4.7
N$17
  Top 0.254: U2.22 80.08,39.02 79.45,39.65 D6.2
N$18
  Top 0.254: D6.1 77.7,41.41 R13.1
N$19
  Top 0.254: R24.1 76.95,58.58 S2.4 S2.3 74.92,48.02 73.7,46.8 67.52,46.8 R27.1
N$20
  Top 0.508: L1.2 C13.1 84.65,23.07 Q3.2
N$21  (via drill 0.35)
  other vias: 23.5,50
N$22  (via drill 0.35)
  Top 0.2: v56.4,17.8 54.9,19.3 42.3,19.3 38.25,23.35 38.25,24.95 34.7,28.5 31.2,28.5 30.7,28 U3.9
  Top 0.254: SW1.1 60.6,22.3 62.92,19.98 R32.2
  Bottom 0.254: SW1.1 57.59,18.99 v56.4,17.8
N$26  (via drill 0.35)
  Top 0.254: C22.1 84.67,50.7 85.67,49.7 95,49.7 95.81,50.51 DEBUG/RACE.2 | v73.6,35.7 73.6,33.9 68,28.3 54.1,28.3 v52.9,27.1 | v83.2,48.2 83.2,50.67 C22.1 | R15.1 C22.1
  Bottom 0.254: JP3.1 41.66,27.8 52.2,27.8 v52.9,27.1 | v73.6,35.7 76.5,38.6 76.5,45.2 79.5,48.2 v83.2,48.2
N$31  (via drill 0.35)
  Top 0.254: v72.2,35.7 72.2,33.4 67.7,28.9 55.1,28.9 v53.7,30.3 | v83,61.7 83,63.73 C21.1 83.17,66.97 83.2,67 R18.1 84.17,68 94.8,68 95.81,66.99 RC/AUTO.2
  Bottom 0.254: JP4.1 41.66,30.3 v53.7,30.3 | v72.2,35.7 75.5,39 75.5,59.4 77.8,61.7 v83,61.7
N$35
  Top 0.254: Q8.1 95.7,17.5 96.65,16.55 J19.1
N$37
  Top 0.2: U3.12 28.66,25.34 28.4,25.6 26.5,25.6 24.5,27.6 22.1,27.6 21.25,26.75 Q1.1
N$38
  Top 0.254: Q8.3 90.6,13.12 R44.1 90.58,11.1 89.58,10.1 82.8,10.1 82.5,10.4 IC1.2
N$39
  Top 0.254: Q3.1 86.55,14.15 85.15,12.75 IC1.4 83.15,13.57 R43.1
N$41  (via drill 0.35)
  Top 0.254: R22.1 77.03,69.33 S1.4 S1.3 75.53,61.33 74.17,59.98 C20.1 74.5,58.6 74.2,58.3 v74.2,57.2 | JP5.1 43.96,37.7 53.4,37.7 v57.2,41.5
  Bottom 0.254: v57.2,41.5 70.7,41.5 74.2,45 v74.2,57.2
N$45
  Top 0.254: R26.1 84.36,5.49 S3.3
N$46  (via drill 0.35)
  Top 0.254: R25.2 83.42,7.2 v84.7,7.2
  Bottom 0.254: v84.7,7.2 87,9.5 95.5,9.5 96.7,8.3 S3.1
POWER_SHUT_DOWN
  Top 0.254: IC1.1 81.85,10.25 80.5,8.9 80.5,3.8 80.8,3.5 83.2,3.5 83.47,3.23 C19.1 84.39,1.39 91.09,1.39 92,2.3 S3.2
PTA0_/_ADC0_SE0
  Top 0.254: JP14.1 47.38,41.74 46.19,40.55 U$1.79
PTA11_/_FTM1_CH5  (via drill 0.35)
  Top 0.254: 34.85,46.55 U$1.91 | 34.85,46.55 34.2,45.9 v34.2,45 | 34.85,46.55 32,49.4 30.3,49.4 29.6,50.1 v29.6,51.1
  Bottom 0.254: JP15.1 27.6,63.25 27.6,62 30.3,59.3 30.3,51.8 v29.6,51.1
PTA12_/_ADC2_SE5
  Top 0.254: JP14.8 47.3,57.74 47.3,54.3 44.2,51.2 44.2,47.7 43.8,47.3 39.3,47.3 38.05,46.05 U$1.90
PTA13_/_ADC2_SE4
  Top 0.254: U$1.89 38.45,45.55 39.7,46.8 44,46.8 44.7,47.5 44.7,50.9 47.8,54 47.8,55.7 JP14.7
PTA14
  Top 0.254: U$1.88 38.75,45.05 40,46.3 44.4,46.3 45.3,47.2 45.3,50.7 49.04,54.44 JP14.6
PTA16_/_ADC1_SE13
  Top 0.254: JP14.4 47.8,48.08 47.8,46.3 43.55,42.05 U$1.82
PTB4_/_ACMP1_IN2
  Top 0.254: U$1.28 19.43,50.08 18.2,51.3 15.7,51.3 13.76,49.36 JP11.5
PTC6_/_ADC1_SE4
  Top 0.254: JP14.3 47.6,45.34 47.6,43.7 45.45,41.55 U$1.81
PTC7_/_ADC1_SE5
  Top 0.254: JP14.2 45.85,41.05 U$1.80
PTC10
  Top 0.254: U$1.52 23.38,32.52 25.4,30.5 41.8,30.5 JP4.2
PTC11
  Top 0.254: U$1.51 22.88,32.22 25.1,30 36.7,30 38.9,27.8 41.2,27.8 42.5,29.1 JP3.2
PTC12
  Top 0.254: U$1.50 21.93,39.08 22.3,38.7 22.3,32 24.8,29.5 36.5,29.5 37.3,28.7 37.3,27.6 39.7,25.2 41.6,25.2 JP2.2
PTC13
  Top 0.254: U$1.49 19.88,39.58 19.6,39.3 19.6,38 21.8,35.8 21.8,31.6 24.4,29 34.92,29 39,24.93 39,23.4 39.7,22.7 42.9,22.7 JP1.2
PTD5_/_FTM2_CH3_/_PWT_IN2  (via drill 0.35)
  Top 0.254: v15.2,47.9 15.53,47.58 U$1.33
  Bottom 0.254: v15.2,47.9 15.2,51.4 13.1,53.5 13.1,59.97 9.48,63.59 JP15.8
PTD6_/_FTM2_FLT2  (via drill 0.35)
  Top 0.254: v16.7,48.5 17.4,48.5 17.82,48.08 U$1.32
  Bottom 0.254: JP15.7 11.01,62.79 13.6,60.2 13.6,53.8 16.7,50.7 v16.7,48.5
PTD7_/_FTM2_FLT3  (via drill 0.35)
  Top 0.254: U$1.31 18.43,48.58 v18.1,48.9
  Bottom 0.254: JP15.6 13.55,61.05 14.1,60.5 14.1,54.3 18.1,50.3 v18.1,48.9
PTD10_/_FTM2_CH0  (via drill 0.35)
  Top 0.254: U$1.36 14.97,46.08 v13.3,44.4
  Bottom 0.254: JP15.9 7.43,63.1 9.29,63.1 12.6,59.79 12.6,48.63 14,47.23 14,45.1 v13.3,44.4
PTE6_/_ADC1_SE11
  Top 0.254: JP14.5 47.68,51.9 46.8,51.02 46.8,47 42.85,43.05 U$1.84
PTE13_/_FTM2_FLT0  (via drill 0.35)
  Top 0.254: U$1.7 31.88,51.12 v32.2,50.8
  Bottom 0.254: JP15.2 26.5,61.81 26.5,53.13 30.13,49.5 31.6,49.5 32.2,50.1 v32.2,50.8
PWT_IN1_/_FXIO_D5  (via drill 0.35)
  Top 0.254: JP10.6 43.99,65.98 45.04,67.03 48.17,67.03 49.66,68.52 J22.6 | U$1.5 32.88,51.12 v33.2,50.8
  Bottom 0.254: v33.2,50.8 33.8,50.8 41.79,58.79 43.49,58.79 43.99,59.29 JP10.6
RTC_CLK_OUT_/_FTM2_CH4
  Top 0.254: U$1.25 22.88,54.12 18.09,58.91 18.09,62.6 JP15.5
SPI0_MISO  (via drill 0.35)
  Top 0.254: Q5.3 62.02,55.9 R34.1 60.92,55.88 60.3,56.5 v60.3,58.2 60.3,71.21 J5.4 | v33.3,49.1 34.85,47.55 U$1.93
  Bottom 0.254: v33.3,49.1 33.3,49.5 42,58.2 v60.3,58.2
SPI0_MOSI  (via drill 0.35)  (1 unrouted)
  Top 0.254: v51.6,49.3 51.98,48.92 R37.1 53.23,48.9 54.2,48.9 54.6,49.3 | v46,49.3 46,47 42.55,43.55 U$1.85 | 56.25,48.9 56.27,48.92 | v54.6,51.6 54.6,49.3 | 54.6,49.3 55,48.9 Q6.3
  Bottom 0.254: v46,49.3 47.3,50.6 50.3,50.6 v51.6,49.3 | J5.5 62.3,71.21 62.3,54.2 61.3,53.2 55.1,53.2 54.6,52.7 v54.6,51.6
SPI0_PCS0  (via drill 0.35)
  Top 0.254: Q7.3 65.17,48.92 R38.1 v62,47.8 62,47 61.5,46.5 53.9,46.5 53.2,45.8 53.2,39 52.41,38.21 42.99,38.21 42.6,38.6 v40.2,38.6 | U$1.54 24.38,38.82 v24.2,39
  Bottom 0.254: v40.2,38.6 29.2,38.6 28.14,39.66 24.86,39.66 v24.2,39
SPI0_PCS3  (via drill 0.35)
  Top 0.254: U$1.83 43.25,42.55 47.3,46.6 47.3,48.3 47.31,48.31 47.31,49.81 48.1,50.6 50.1,50.6 51,51.5 v51,53.9 | v61.3,67.8 63.5,67.8 63.9,68.2 63.9,70.81 J5.6
  Bottom 0.254: v51,53.9 60.9,53.9 61.5,54.5 61.5,62.6 60.3,63.8 60.3,66.8 v61.3,67.8
SPI0_SCK  (via drill 0.35)
  Top 0.254: J5.3 59.24,69.54 57.5,67.8 53.6,67.8 52,66.2 52,57.17 R33.1 53.27,55.9 | U$1.94 35.45,48.05 v34.4,49.1 | 53.27,55.9 Q4.3 | v51,55.7 53.08,55.7 53.27,55.9
  Bottom 0.254: v34.4,49.1 34.4,49.8 40.3,55.7 v51,55.7
UART0_RX  (via drill 0.35)
  Top 0.254: U$1.73 33.88,35.22 v35.2,33.9
  Bottom 0.254: J7.4 37.39,4.01 35.3,6.1 35.3,16.6 34.5,17.4 34.5,33.2 v35.2,33.9
UART0_TX  (via drill 0.35)
  Top 0.254: U$1.72 33.38,34.72 v35.2,32.9
  Bottom 0.254: v35.2,32.9 35.2,17.5 35.9,16.8 35.9,6.4 39.39,2.91 J7.3
UART1_CTS  (via drill 0.35)
  Top 0.254: U$1.58 26.4,37.2 v26.4,39 | v74.9,29.4 76,30.5 77.2,30.5 77.5,30.2 77.5,29.37 U2.3
  Bottom 0.254: v26.4,39 26.4,37.4 26.9,36.9 52.2,36.9 55.9,33.2 55.9,26.3 56.9,25.3 65.2,25.3 68.8,28.9 74.4,28.9 v74.9,29.4
UART1_RTS  (via drill 0.35)
  Top 0.254: U$1.57 25.88,38.32 v25.2,39 | U2.11 82.67,27.98 v82.2,27.5
  Bottom 0.254: v25.2,39 25.9,38.3 25.9,37.1 26.6,36.4 51.9,36.4 55.4,32.9 55.4,26.1 56.7,24.8 65.6,24.8 69,28.2 78.9,28.2 79.6,27.5 v82.2,27.5
UART1_RX  (via drill 0.35)
  Top 0.254: U2.1 76.17,27.57 v75.4,26.8 | U$1.56 25.38,35.28 v24.6,34.5
  Bottom 0.254: v75.4,26.8 69.5,26.8 66.6,23.9 56.12,23.9 54.39,25.63 54.39,32.31 51.3,35.4 25.5,35.4 v24.6,34.5
UART1_TX  (via drill 0.35)
  Top 0.254: U2.5 78.78,28.18 v78.1,27.5 | U$1.55 24.88,35.78 v24.6,35.5
  Bottom 0.254: v78.1,27.5 69.2,27.5 66.05,24.35 56.45,24.35 54.9,25.9 54.9,32.6 51.6,35.9 25,35.9 v24.6,35.5
UART2_CTS  (via drill 0.35)
  Top 0.254: U$1.35 13.78,46.58 v13.2,46
  POWER 0.254: J8.5 5.76,50.14 10.3,45.6 12.8,45.6 v13.2,46
UART2_RTS  (via drill 0.35)
  Top 0.254: v13.2,47.1 20.98,47.1 U$1.34
  POWER 0.254: v13.2,47.1 12.1,48.2 9.7,48.2 5.76,52.14 J8.6
UART2_RX  (via drill 0.35)
  Top 0.254: U$1.20 25.38,56.52 23.7,58.2 v21.9,58.2 | J8.4 7.34,48.14 8.1,48.9 8.1,56.8 9.5,58.2 v16.6,58.2
  Bottom 0.254: v16.6,58.2 v21.9,58.2
UART2_TX  (via drill 0.35)
  Top 0.254: U$1.19 25.88,57.02 23.6,59.3 v21.9,59.3 | J8.3 7.74,46.14 8.8,47.2 8.8,55.1 9.4,55.7 v15.9,55.7
  Bottom 0.254: v15.9,55.7 15.9,58.8 16.4,59.3 v21.9,59.3
VBUS
  Top 0.508: CN1.1 93.5,35.4 91.28,33.17 FB1.1

## Text on the board
tPlace: 3V3 | 3V3 | GND | GND | PTD10 | PTD5 | PTD6 | PTD7 | PTD13 | PTD14 | PTE9 | PTE13 | PTA11 | PTD0 | PTD1 | PTE15 | PTE16 | PTE10 | PTE11 | PTA8 | PTA9 | PTE14 | PTA12 | PTD16 | PTA13 | PTD15 | PTA14 | PTE8 | PTE6 | PTB4 | PTA16 | PTC3 | PTC6 | PTE3 | PTC7 | PTB5 | PTA0 | PTC2 | PTB1 | PTC17 | PTC10 | PTC16 | PTC11 | PTC12 | + | PTC13 | VDD | GND | VDD | PTD4 | PTD3 | PTD2 | PTB11 | PTB10 | PTB9 | PTB8 | PTA1 | VDD | 1V8 | GND | GND | GND | GND | +
bPlace: UW ROBOTICS 2019 | HUMMINGBOT | DESIGNED BY: TSUGUMI MURATA